# EAGLE design MPC_IR_Blaster (EAGLE 5.11)
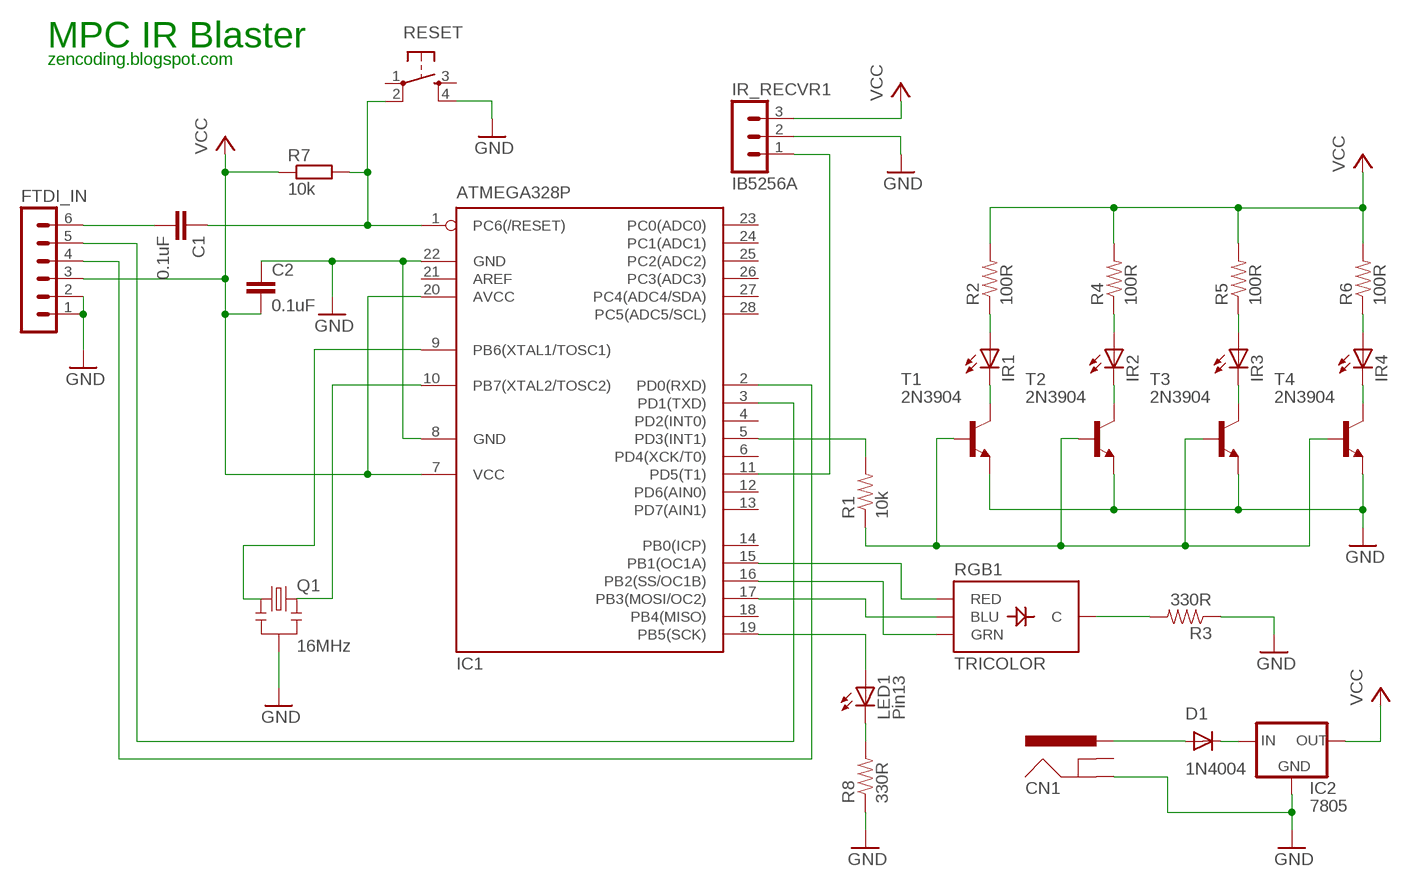
[diagram p0: schematic, sheet 1]

## Parts
C1  0.1uF  C5/2.5  [C5B2.5]
C2  0.1uF  C5/2.5  [C5B2.5]
CN1  POWER_JACKPTH  [POWER_JACK_PTH]
D1  1N4004  [DO41-10]
FTDI_IN  MA06-1  [MA06-1]
IC1  ATMEGA328P  MEGA8-P  [DIL28-3]
IC2  7805  V_REG_78XXSINK  [TO220-IGO]
IR1  LED5MM  [LED5MM]
IR2  LED5MM  [LED5MM]
IR3  LED5MM  [LED5MM]
IR4  LED5MM  [LED5MM]
IR_RECVR1  IB5256A  MA03-1  [MA03-1]
LED1  Pin13  LED5MM  [LED5MM]
Q1  16MHz  RESONATORPTH  [RESONATOR-PTH]
R1  10k  RESISTORAXIAL-0.3  [AXIAL-0.3]
R2  100R  RESISTORAXIAL-0.3  [AXIAL-0.3]
R3  330R  RESISTORAXIAL-0.3  [AXIAL-0.3]
R4  100R  RESISTORAXIAL-0.3  [AXIAL-0.3]
R5  100R  RESISTORAXIAL-0.3  [AXIAL-0.3]
R6  100R  RESISTORAXIAL-0.3  [AXIAL-0.3]
R7  10k  R-EU_0207/12  [0207/12]
R8  330R  RESISTORAXIAL-0.3  [AXIAL-0.3]
RESET  TAC_SWITCHPTH  [TACTILE-PTH]
RGB1  TRICOLOR  LED-TRICOLOR-THROUGHHOLE  [LED-TRICOLOR-THROUGHHOLE]
T1  2N3904  [TO92]
T2  2N3904  [TO92]
T3  2N3904  [TO92]
T4  2N3904  [TO92]

## Nets
DIGI_10: C1.1 IC1.1(PC6(/RESET)) R7.2 RESET.2
GND: C2.1 CN1.GND FTDI_IN.1 FTDI_IN.2 IC1.8(GND) IC1.22(GND) IC2.GND IR_RECVR1.2 Q1.2 R3.P$1 R8.P$1 RESET.4 T1.3(E) T2.3(E) T3.3(E) T4.3(E)
N$1: IR1.A R2.P$1
N$2: IR1.K(C) T1.1(C)
N$3: R1.P$1 T1.2(B) T2.2(B) T3.2(B) T4.2(B)
N$4: IC1.15(PB1(OC1A)) RGB1.RED
N$5: IR2.A R4.P$1
N$6: IR2.K(C) T2.1(C)
N$7: IR3.A R5.P$1
N$8: IR3.K(C) T3.1(C)
N$9: IR4.A R6.P$1
N$10: IR4.K(C) T4.1(C)
N$11: C1.2 FTDI_IN.6
N$12: IC1.10(PB7(XTAL2/TOSC2)) Q1.3
N$13: IC1.9(PB6(XTAL1/TOSC1)) Q1.1
N$14: FTDI_IN.4 IC1.2(PD0(RXD))
N$15: FTDI_IN.5 IC1.3(PD1(TXD))
N$16: IC1.19(PB5(SCK)) LED1.A
N$17: LED1.K(C) R8.P$2
N$18: IC1.16(PB2(SS/OC1B)) RGB1.GRN
N$19: D1.C IC2.IN
N$20: CN1.PWR D1.A
N$21: IC1.17(PB3(MOSI/OC2)) RGB1.BLU
N$22: R3.P$2 RGB1.GND(C)
PIN3: IC1.5(PD3(INT1)) R1.P$2
PIN5: IC1.11(PD5(T1)) IR_RECVR1.1
VCC: C2.2 FTDI_IN.3 IC1.7(VCC) IC1.20(AVCC) IC2.OUT IR_RECVR1.3 R2.P$2 R4.P$2 R5.P$2 R6.P$2 R7.1
Unconnected: CN1.GNDBREAK IC1.4(PD2(INT0)) IC1.6(PD4(XCK/T0)) IC1.12(PD6(AIN0)) IC1.13(PD7(AIN1)) IC1.14(PB0(ICP)) IC1.18(PB4(MISO)) IC1.21(AREF) IC1.23(PC0(ADC0)) IC1.24(PC1(ADC1)) IC1.25(PC2(ADC2)) IC1.26(PC3(ADC3)) IC1.27(PC4(ADC4/SDA)) IC1.28(PC5(ADC5/SCL)) RESET.1 RESET.3

## Notes on the sheet
- MPC IR Blaster
- zencoding.blogspot.com

## Library data of the parts
C1 C2 = capacitor-wima:C: CAPACITOR naming: grid - package width
CN1 = SparkFun:POWER_JACK: Power Jack This is the standard 5.5mm barrel jack for power. The PTH is the most common, proven, reliable, footprint. All others are experimental. The Slot footprint only works if the mill layer is transmitted to the PCB fab house so be warned. Spark Fun Electronics SKU : PRT-00119. Mating wall wart : TOL-00298 (and others)
D1 = adafruit:1N4004: DIODE General purpose 1N400x type rectifier (With bigger pads) http://www.ladyada.net/library/pcb/eaglelibrary.html
FTDI_IN = con-lstb:MA06-1: PIN HEADER; OC_FARNELL: unknown; OC_NEWARK: unknown
IC1 = atmel:MEGA8-P: MICROCONTROLLER 8 Kbytes FLASH, 1 kbytes SRAM, 512 bytes EEPROM, USART, 4-channel 10 bit ADC, 2-channel 8 bit ADC Pin compatible with Atmega48, ATMega88, ATMega168 Source: avr.lbr; OC_FARNELL: unknown; OC_NEWARK: unknown
IC2 = SparkFun:V_REG_78XX: Voltage Regulator Standard 7805 5V regulator. IGO (Input Ground Output). Spark Fun Electronics SKU : COM-00107
IR1-IR4 = led:LED: LED
IR_RECVR1 = con-lstb:MA03-1: PIN HEADER; OC_FARNELL: unknown; OC_NEWARK: unknown
LED1 = adafruit:LED: LED
Q1 = SparkFun:RESONATOR: Resonator Small SMD resonator. This is the itty bitty 10/20MHz resonators with built in caps. CSTCE10M0G55 and CSTCE20M0V53. Footprint has been reviewed closely but hasn't been tested yet.
R1-R6 R8 = SparkFun:RESISTOR: Resistor Basic schematic elements and footprints for 0603, 1206, and PTH resistors.
R7 = resistor:R-EU_: RESISTOR, European symbol
RESET = SparkFun:TAC_SWITCH: Momentary Switch Button commonly used for reset or general input. Spark Fun Electronics SKU : COM-00097
RGB1 = SparkFun:LED-TRICOLOR-THROUGHHOLE
T1-T4 = transistor:2N3904: NPN TRANSISTOR

## Board
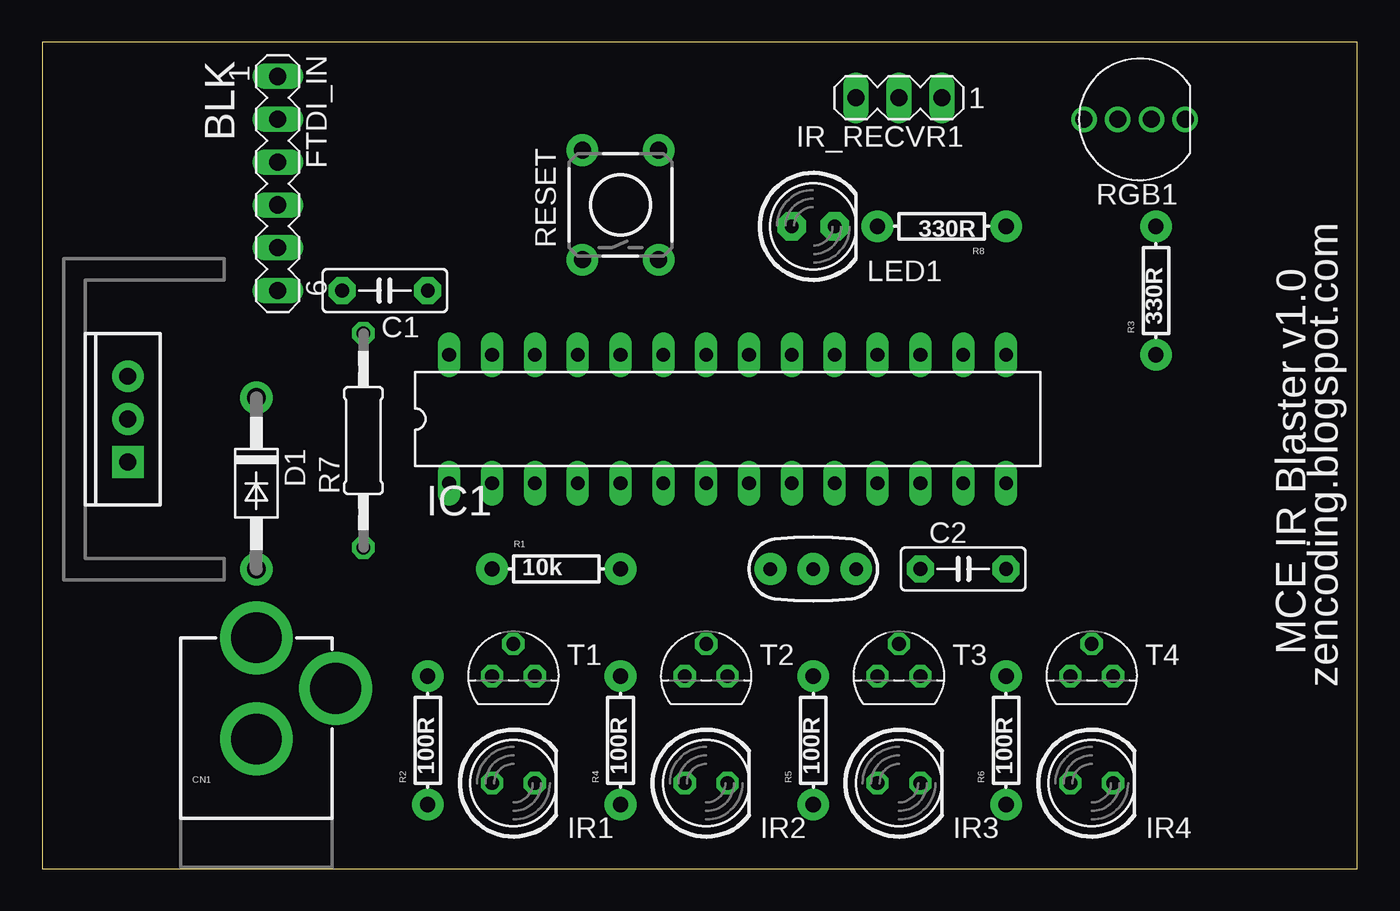
[diagram p1: board, top side]
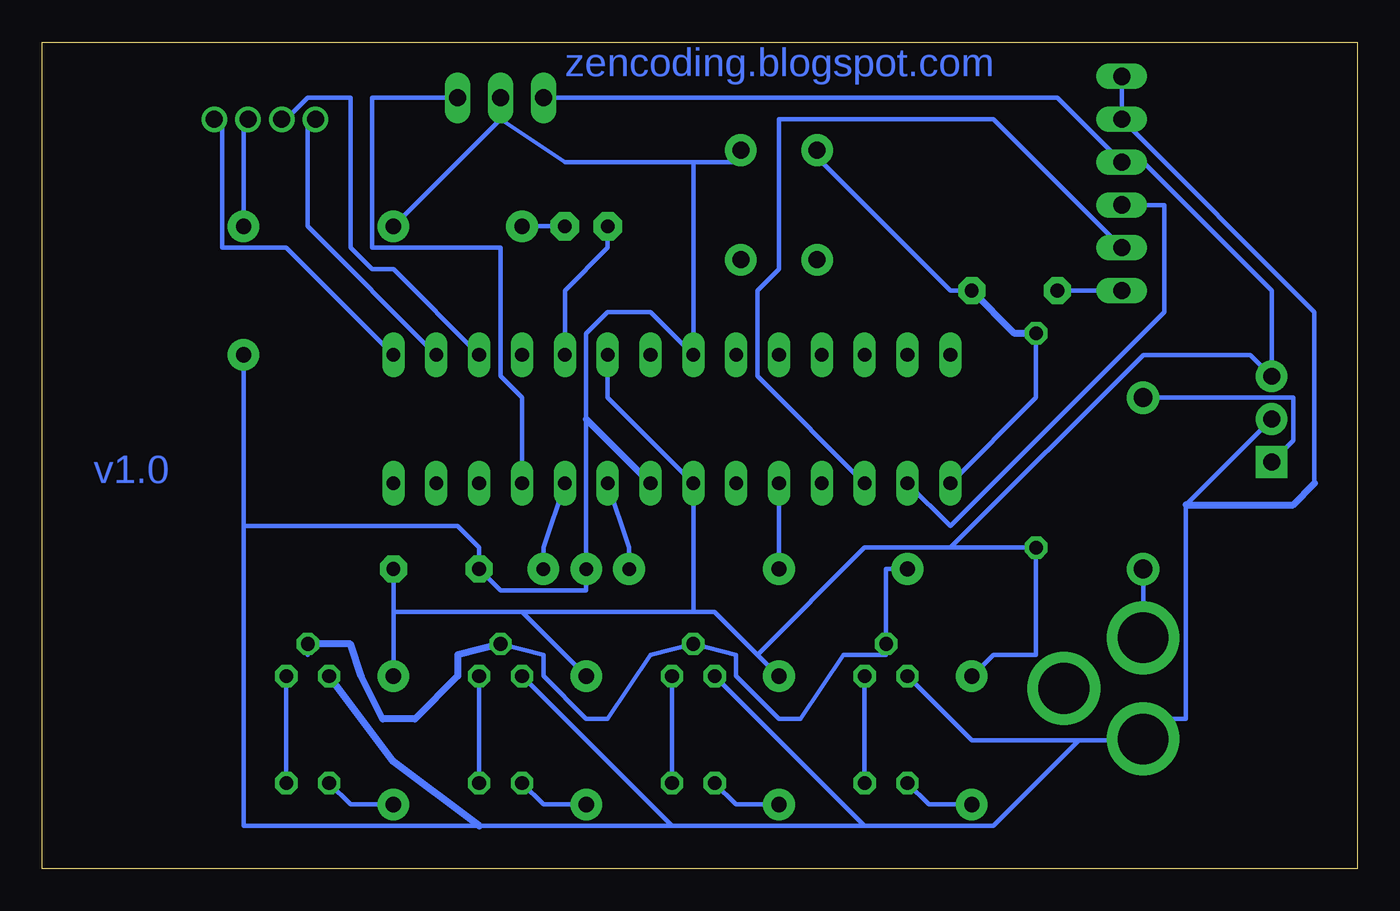
[diagram p2: board, bottom side, seen from below]

Size 77.98 x 49.02 mm. Coordinates in mm from the lower left corner, seen from the top.
Outline: 0,0 77.98,0 77.98,49.02 0,49.02 0,0
Copper layers (1*16): Top 0.035mm / dielectric 1.5mm / Bottom 0.035mm
Design rules "default *": minimum track width 10mil, minimum drill 24mil, track to track 8mil, track to pad 8mil, pad to pad 8mil, via to via 8mil, smd to smd 8mil, copper to edge 40mil, drill to drill 8mil, minimum pad ring 10mil, minimum via ring 8mil, stop-mask expansion 4mil, vias tented up to drill 0mil, thermal gap 10mil
bRestrict: area 0,0 to 8,8; area 0,41.3 to 8,49.3; area 69.8,0 to 77.9,8; area 70.1,40.9 to 78.1,48.9

### Footprints (pad centres in the part's own frame; a part is rotated, then mirrored left to right if it is on the bottom)
C5B2.5 = drill 0.813 pad 1.6 octagon: 1 -2.54,0; 2 2.54,0
POWER_JACK_PTH = drill 2.997 pad 4.318 round: GND 0,7.7; GNDBREAK 4.7,10.7; PWR 0,13.7
DO41-10 = drill 1.118 pad 1.93 round: A 5.08,0; C -5.08,0
MA06-1 = drill 1.016 long: 1 -6.35,0; 2 -3.81,0; 3 -1.27,0; 4 1.27,0; 5 3.81,0; 6 6.35,0
DIL28-3 = drill 0.813 long: 1 -16.51,-3.81; 2 -13.97,-3.81; 3 -11.43,-3.81; 4 -8.89,-3.81; 5 -6.35,-3.81; 6 -3.81,-3.81; 7 -1.27,-3.81; 8 1.27,-3.81; 9 3.81,-3.81; 10 6.35,-3.81; 11 8.89,-3.81; 12 11.43,-3.81; 13 13.97,-3.81; 14 16.51,-3.81; 15 16.51,3.81; 16 13.97,3.81; 17 11.43,3.81; 18 8.89,3.81; 19 6.35,3.81; 20 3.81,3.81; 21 1.27,3.81; 22 -1.27,3.81; 23 -3.81,3.81; 24 -6.35,3.81; 25 -8.89,3.81; 26 -11.43,3.81; 27 -13.97,3.81; 28 -16.51,3.81
TO220-IGO = drill 1 pad 1.88 round: GND 0,0; OUT 2.54,0 | drill 1 pad 1.88 square: IN -2.54,0
LED5MM = drill 0.813 octagon: A -1.27,0; K 1.27,0
MA03-1 = drill 1.016 long: 1 -2.54,0; 2 0,0; 3 2.54,0
LED5MM' = drill 0.813 pad 1.676 octagon: A -1.27,0; K 1.27,0
RESONATOR-PTH = drill 0.8 pad 1.88 round: 1 -2.54,0; 2 0,0; 3 2.54,0
AXIAL-0.3 = drill 0.9 pad 1.88 round: P$1 -3.81,0; P$2 3.81,0
0207/12 = drill 0.813 octagon: 1 -6.35,0; 2 6.35,0
TACTILE-PTH = drill 1.016 pad 1.88 round: 1 -3.251,2.261; 2 3.251,2.261; 3 -3.251,-2.261; 4 3.251,-2.261
LED-TRICOLOR-THROUGHHOLE = drill 1 round: BLU 1,0; GND -1,0; GRN 3,0; RED -3,0
TO92 = drill 0.813 octagon: 1 1.27,0; 2 0,1.905; 3 -1.27,0

### Placement (x,y rotation side)
C1  20.32,34.29 180 top
C2  54.61,17.78 0 top
CN1  12.7,0 0 top
D1  12.7,22.86 270 top
FTDI_IN  13.97,40.64 270 top
IC1  40.64,26.67 0 top
IC2  5.08,26.67 90 top
IR1  27.94,5.08 0 top
IR2  39.37,5.08 0 top
IR3  50.8,5.08 0 top
IR4  62.23,5.08 0 top
IR_RECVR1  50.8,45.72 180 top
LED1  Pin13  [LED5MM']  45.72,38.1 0 top
Q1  45.72,17.78 0 top
R1  30.48,17.78 0 top
R2  22.86,7.62 90 top
R3  66.04,34.29 90 top
R4  34.29,7.62 90 top
R5  45.72,7.62 90 top
R6  57.15,7.62 90 top
R7  19.05,25.4 90 top
R8  53.34,38.1 180 top
RESET  34.29,39.37 90 top
RGB1  64.77,44.45 180 top
T1  27.94,11.43 0 top
T2  39.37,11.43 0 top
T3  50.8,11.43 0 top
T4  62.23,11.43 0 top

### Tracks (layer width: path | path; a pad name or v marks a point on that pad's centre or on a via)
DIGI_10
  Bottom 0.254: IC1.1 19.05,27.94 R7.2 | C1.1 24.13,34.29 31.75,41.91 RESET.2
  Bottom 0.406: R7.2 20.32,31.75 C1.1
GND
  Bottom 0.254: 39.37,41.91 IC1.22 41.91,33.02 44.45,33.02 45.72,31.75 45.72,26.67 Q1.2 45.72,16.51 50.8,16.51 C2.1 52.07,19.05 53.34,20.32 66.04,20.32 | 39.37,41.91 36.83,41.91 RESET.4 | 50.8,44.45 46.99,41.91 39.37,41.91 | 50.8,44.45 IR_RECVR1.2 | 50.8,44.45 R8.P$1 | FTDI_IN.1 FTDI_IN.2 2.54,33.02 2.54,22.86 | T1.3 22.86,7.62 16.51,7.62 | 16.51,7.62 12.7,7.62 CN1.GND 12.7,8.89 10.16,8.89 10.16,21.59 IC2.GND | 29.21,2.54 T2.3 | 29.21,2.54 21.59,2.54 16.51,7.62 | 40.64,2.54 T3.3 | 29.21,2.54 40.64,2.54 | 40.64,2.54 52.07,2.54 66.04,2.54 66.04,20.32 | 66.04,20.32 R3.P$1
  Bottom 0.406: 52.07,2.54 57.15,6.35 T4.3 | 2.54,22.86 3.81,21.59 10.16,21.59 | 45.72,26.67 IC1.8
N$1
  Bottom 0.254: IR1.A 25.4,3.81 R2.P$1
N$2
  Bottom 0.254: IR1.K T1.1
N$3
  Bottom 0.254: R1.P$1 27.94,17.78 T1.2 27.94,12.7 30.48,12.7 33.02,8.89 34.29,8.89 36.83,11.43 36.83,12.7 T2.2 41.91,12.7 44.45,8.89 45.72,8.89 48.26,11.43 48.26,12.7 T3.2 | T4.2 62.23,12.7
  Bottom 0.406: T3.2 53.34,12.7 53.34,11.43 55.88,8.89 57.78,8.89 59.05,11.43 59.69,13.34 T4.2
N$4
  Bottom 0.254: IC1.15 63.5,36.83 67.31,36.83 67.31,44.45 RGB1.RED
N$5
  Bottom 0.254: IR2.A 36.83,3.81 R4.P$1
N$6
  Bottom 0.254: IR2.K T2.1
N$7
  Bottom 0.254: IR3.A 48.26,3.81 R5.P$1
N$8
  Bottom 0.254: IR3.K T3.1
N$9
  Bottom 0.254: IR4.A 59.69,3.81 R6.P$1
N$10
  Bottom 0.254: IR4.K T4.1
N$11
  Bottom 0.254: FTDI_IN.6 C1.2
N$12
  Bottom 0.254: IC1.10 48.26,19.05 Q1.3
N$13
  Bottom 0.254: IC1.9 43.18,19.05 Q1.1
N$14
  Bottom 0.254: IC1.2 24.13,20.32 11.43,33.02 11.43,39.37 FTDI_IN.4
N$15
  Bottom 0.254: IC1.3 35.56,29.21 35.56,34.29 34.29,35.56 34.29,44.45 21.59,44.45 FTDI_IN.5
N$16
  Bottom 0.254: IC1.19 46.99,34.29 44.45,36.83 LED1.A
N$17
  Bottom 0.254: LED1.K R8.P$2
N$18
  Bottom 0.254: IC1.16 62.23,38.1 62.23,44.45 RGB1.GRN
N$19
  Bottom 0.254: IC2.IN 3.81,25.4 3.81,27.94 D1.C
N$20
  Bottom 0.254: CN1.PWR D1.A
N$21
  Bottom 0.254: IC1.17 57.15,35.56 58.42,35.56 59.69,36.83 59.69,45.72 62.23,45.72 63.5,44.45 RGB1.BLU
N$22
  Bottom 0.254: R3.P$2 66.04,44.45 RGB1.GND
PIN3
  Bottom 0.254: R1.P$2 IC1.5
PIN5
  Bottom 0.254: IC1.11 49.53,27.94 50.8,29.21 50.8,36.83 58.42,36.83 58.42,45.72 IR_RECVR1.1
VCC
  Bottom 0.254: IR_RECVR1.3 17.78,45.72 FTDI_IN.3 12.7,41.91 5.08,34.29 IC2.OUT 6.35,30.48 12.7,30.48 24.13,19.05 | R2.P$2 21.59,12.7 19.05,12.7 R7.1 24.13,19.05 | IC1.20 44.45,27.94 IC1.7 39.37,15.24 | 49.53,15.24 57.15,15.24 | 57.15,15.24 C2.2 | 49.53,15.24 R5.P$2 | 35.56,12.7 38.1,15.24 39.37,15.24 | 35.56,12.7 R4.P$2 | 39.37,15.24 49.53,15.24 | 24.13,19.05 29.21,19.05 35.56,12.7 | 57.15,15.24 R6.P$2

### Text on the board
Bottom: zencoding.blogspot.com | v1.0
tNames: BLK | MCE IR Blaster v1.0 | zencoding.blogspot.com